# EAGLE design pcb_univ_3-1-0-x-rev2 (EAGLE 7.3.0)
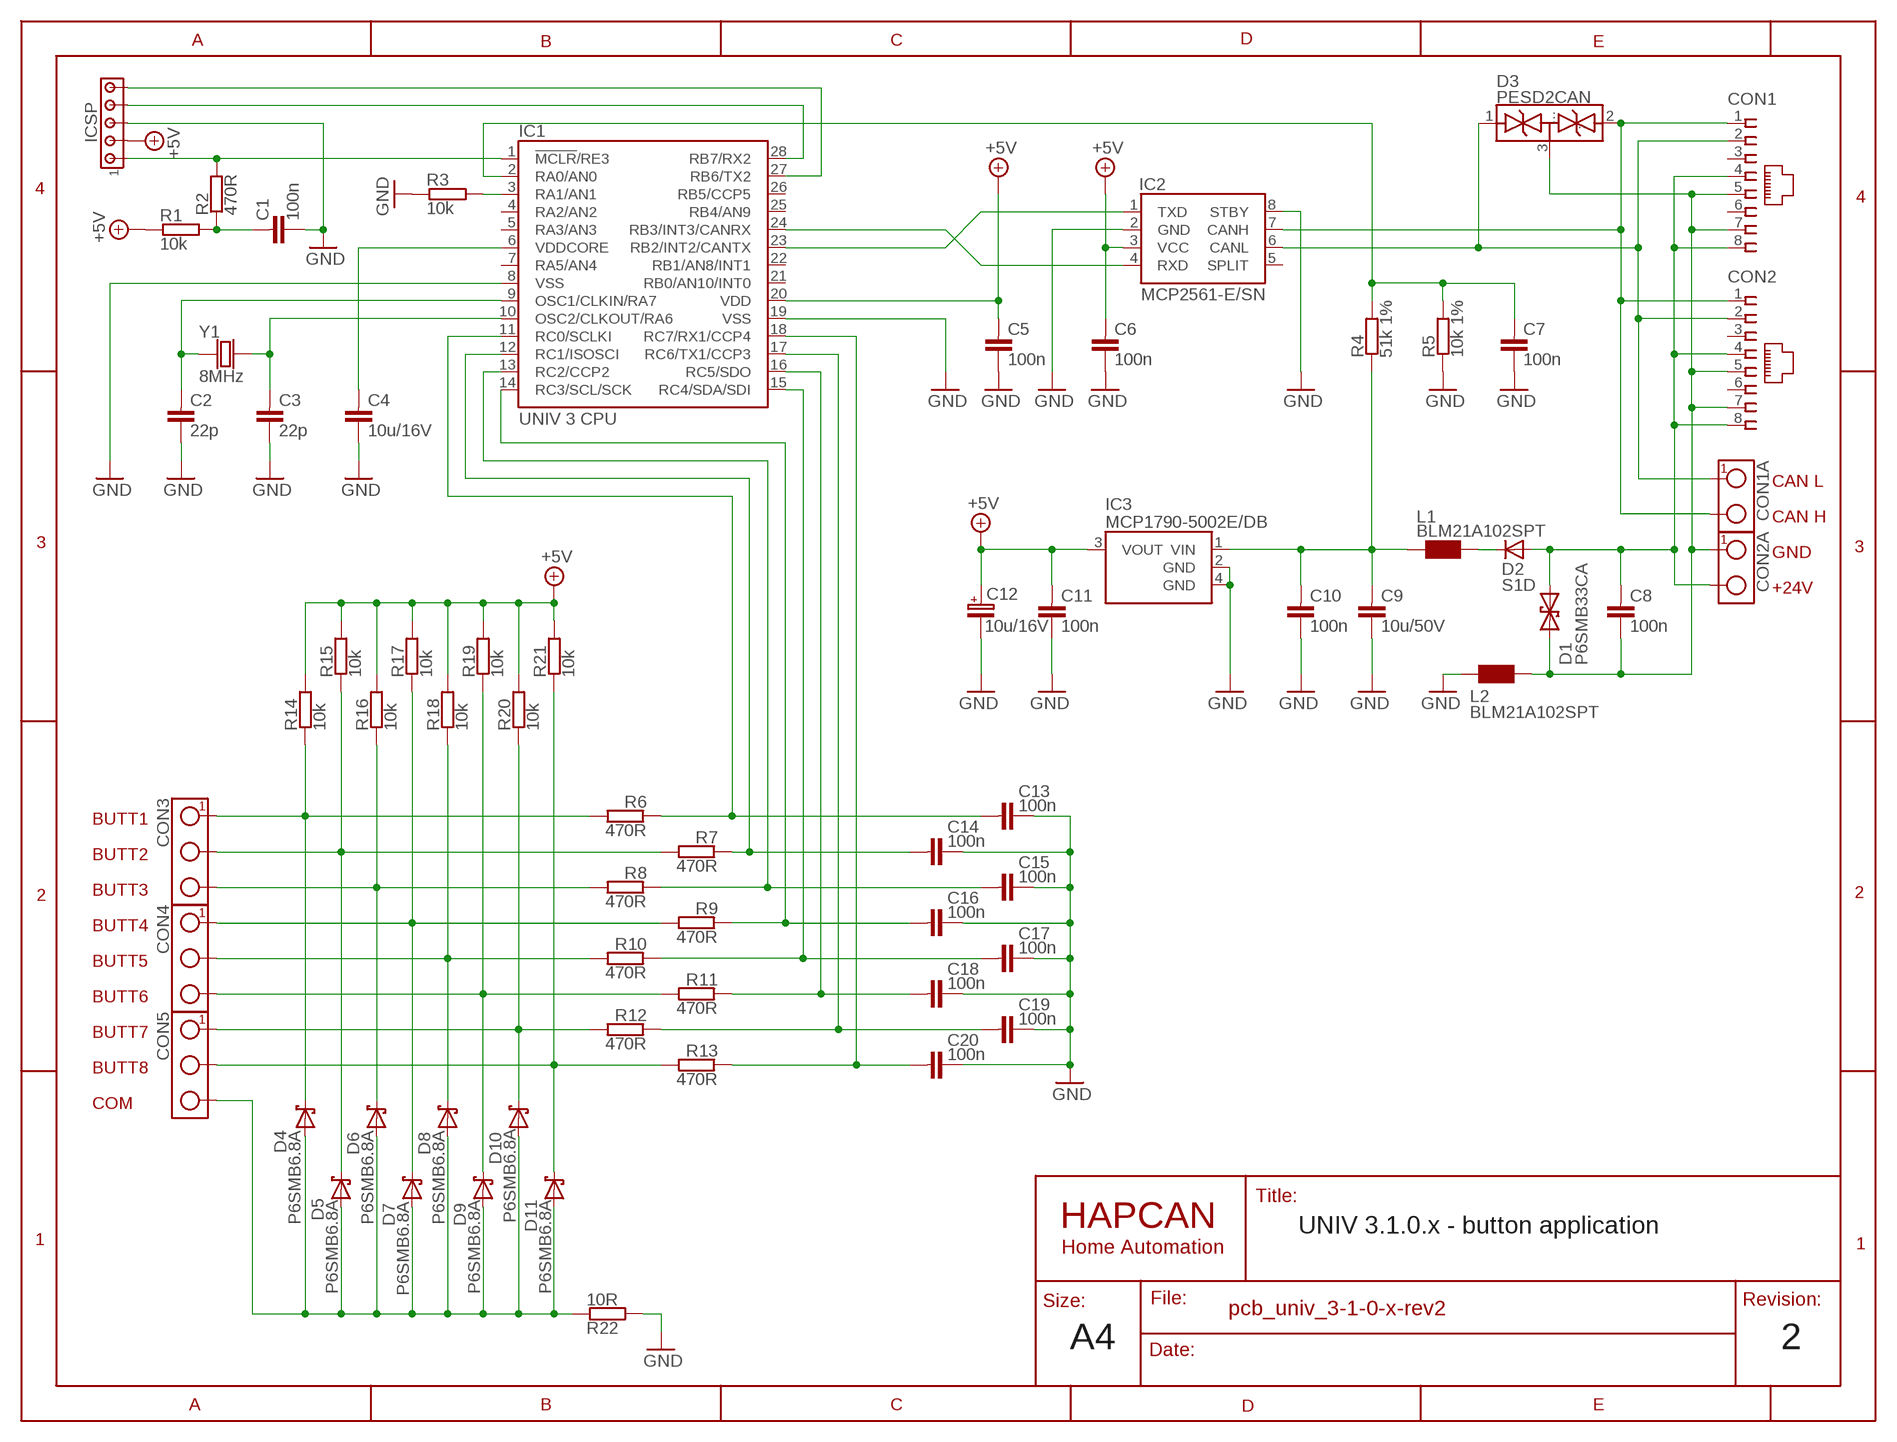
[diagram p0: schematic, sheet 1]

## Parts
C1  100n  CAPACITOR0805  [0805]
C2  22p  CAPACITOR0805  [0805]
C3  22p  CAPACITOR0805  [0805]
C4  10u/16V  CAPACITOR0805  [0805]
C5  100n  CAPACITOR0805  [0805]
C6  100n  CAPACITOR0805  [0805]
C7  100n  CAPACITOR0805  [0805]
C8  100n  CAPACITOR0805  [0805]
C9  10u/50V  CAPACITOR1210  [1210]
C10  100n  CAPACITOR0805  [0805]
C11  100n  CAPACITOR0805  [0805]
C12  10u/16V  CAPACITOR-POLARIZED-SMC_B  [SMC_B]
C13  100n  CAPACITOR0805  [0805]
C14  100n  CAPACITOR0805  [0805]
C15  100n  CAPACITOR0805  [0805]
C16  100n  CAPACITOR0805  [0805]
C17  100n  CAPACITOR0805  [0805]
C18  100n  CAPACITOR0805  [0805]
C19  100n  CAPACITOR0805  [0805]
C20  100n  CAPACITOR0805  [0805]
CON1  RJ45-SOCKET  [RJ45-PCB-SOCKET]
CON1A  TERMINAL-2  TERMINAL-2-5X10,5MM  [ARK2-5X10,5MM]
CON2  RJ45-SOCKET  [RJ45-PCB-SOCKET]
CON2A  TERMINAL-2  TERMINAL-2-5X10,5MM  [ARK2-5X10,5MM]
CON3  TERMINAL-3  TERMINAL-3-5X10.5MM  [ARK3-5X10.5MM]
CON4  TERMINAL-3  TERMINAL-3-5X10.5MM  [ARK3-5X10.5MM]
CON5  TERMINAL-3  TERMINAL-3-5X10.5MM  [ARK3-5X10.5MM]
D1  P6SMB33CA  DIODE_TRANSIL2  [DO-214_TRANSIL2]
D2  S1D  DIODE_DO-214  [DO-214]
D3  PESD2CAN  PESD2CANSOT-23  [SOT-23]
D4  P6SMB6.8A  DIODE_TRANSIL1_DO214  [DO-214]
D5  P6SMB6.8A  DIODE_TRANSIL1_DO214  [DO-214]
D6  P6SMB6.8A  DIODE_TRANSIL1_DO214  [DO-214]
D7  P6SMB6.8A  DIODE_TRANSIL1_DO214  [DO-214]
D8  P6SMB6.8A  DIODE_TRANSIL1_DO214  [DO-214]
D9  P6SMB6.8A  DIODE_TRANSIL1_DO214  [DO-214]
D10  P6SMB6.8A  DIODE_TRANSIL1_DO214  [DO-214]
D11  P6SMB6.8A  DIODE_TRANSIL1_DO214  [DO-214]
IC1  UNIV 3 CPU  UNIV3CPU-I/SO  [UNIV3CPU]
IC2  MCP2561-E/SN  [SO-08]
IC3  MCP1790-5002E/DB  MCP1790  [SOT-223]
ICSP  HEADER5  [SIP-5]
L1  BLM21A102SPT  CHOKE0805  [0805]
L2  BLM21A102SPT  CHOKE0805  [0805]
R1  10k  RESISTOR0805  [0805]
R2  470R  RESISTOR0805  [0805]
R3  10k  RESISTOR0805  [0805]
R4  51k 1%  RESISTOR0805  [0805]
R5  10k 1%  RESISTOR0805  [0805]
R6  470R  RESISTOR0805  [0805]
R7  470R  RESISTOR0805  [0805]
R8  470R  RESISTOR0805  [0805]
R9  470R  RESISTOR0805  [0805]
R10  470R  RESISTOR0805  [0805]
R11  470R  RESISTOR0805  [0805]
R12  470R  RESISTOR0805  [0805]
R13  470R  RESISTOR0805  [0805]
R14  10k  RESISTOR0805  [0805]
R15  10k  RESISTOR0805  [0805]
R16  10k  RESISTOR0805  [0805]
R17  10k  RESISTOR0805  [0805]
R18  10k  RESISTOR0805  [0805]
R19  10k  RESISTOR0805  [0805]
R20  10k  RESISTOR0805  [0805]
R21  10k  RESISTOR0805  [0805]
R22  10R  RESISTOR0805  [0805]
Y1  8MHz  CRYSTAL-HC49V  [CRYSTAL-HC49V]

## Nets
+5V: C5.1 C6.1 C11.1 C12.+ IC1.20(VDD) IC2.3(VCC) IC3.3(VOUT) ICSP.2 R1.1 R14.2 R15.2 R16.2 R17.2 R18.2 R19.2 R20.2 R21.2
GND: C1.2 C2.2 C3.2 C4.2 C5.2 C6.2 C7.2 C9.2 C10.2 C11.2 C12.- C13.2 C14.2 C15.2 C16.2 C17.2 C18.2 C19.2 C20.2 IC1.8(VSS) IC1.19(VSS) IC2.2(GND) IC2.8(STBY) IC3.2(GND) IC3.4(GND) ICSP.3 L2.1 R3.1 R5.1 R22.2
N$1: CON5.3 D4.A D5.A D6.A D7.A D8.A D9.A D10.A D11.A R22.1
N$2: IC1.24(RB3/INT3/CANRX) IC2.4(RXD)
N$3: IC1.23(RB2/INT2/CANTX) IC2.1(TXD)
N$4: CON1.1 CON1A.2 CON2.1 D3.2(..) IC2.7(CANH)
N$5: CON3.1 D4.C R6.2 R14.1
N$6: CON3.3 D6.C R8.2 R16.1
N$7: C1.1 R1.2 R2.1
N$8: IC1.1(!MCLR!/RE3) ICSP.1 R2.2
N$9: C8.1 CON1.4 CON1.8 CON2.4 CON2.8 CON2A.2 D1.A D2.A
N$10: IC1.28(RB7/RX2) ICSP.4
N$11: C14.1 IC1.12(RC1/ISOSCI) R7.1
N$12: IC1.3(RA1/AN1) R3.2
N$13: CON3.2 D5.C R7.2 R15.1
N$14: IC1.27(RB6/TX2) ICSP.5
N$15: C3.1 IC1.10(OSC2/CLKOUT/RA6) Y1.2
N$16: C7.1 IC1.2(RA0/AN0) R4.2 R5.2
N$17: C9.1 C10.1 IC3.1(VIN) L1.1 R4.1
N$18: C8.2 CON1.5 CON1.7 CON2.5 CON2.7 CON2A.1 D1.C D3.3(...) L2.2
N$19: C15.1 IC1.13(RC2/CCP2) R8.1
N$21: CON4.1 D7.C R9.2 R17.1
N$22: C16.1 IC1.14(RC3/SCL/SCK) R9.1
N$23: CON4.3 D9.C R11.2 R19.1
N$24: CON5.1 D10.C R12.2 R20.1
N$25: C13.1 IC1.11(RC0/SCLKI) R6.1
N$27: CON1.2 CON1A.1 CON2.2 D3.1(.) IC2.6(CANL)
N$29: C17.1 IC1.15(RC4/SDA/SDI) R10.1
N$30: CON4.2 D8.C R10.2 R18.1
N$32: CON5.2 D11.C R13.2 R21.1
N$40: C2.1 IC1.9(OSC1/CLKIN/RA7) Y1.1
N$45: C18.1 IC1.16(RC5/SDO) R11.1
N$46: C19.1 IC1.17(RC6/TX1/CCP3) R12.1
N$47: C20.1 IC1.18(RC7/RX1/CCP4) R13.1
N$56: C4.1 IC1.6(VDDCORE)
N$67: D2.C L1.2
Unconnected: CON1.3 CON1.6 CON2.3 CON2.6 IC1.4(RA2/AN2) IC1.5(RA3/AN3) IC1.7(RA5/AN4) IC1.21(RB0/AN10/INT0) IC1.22(RB1/AN8/INT1) IC1.25(RB4/AN9) IC1.26(RB5/CCP5) IC2.5(SPLIT)

## Notes on the sheet
- CAN L
- CAN H
- GND
- +24V
- BUTT1
- BUTT2
- BUTT3
- BUTT4
- BUTT5
- BUTT6
- BUTT7
- BUTT8
- COM
- UNIV 3.1.0.x - button application
- A4 | 2

## Library data of the parts
C1-C11 C13-C20 = HAPCAN_devices - UNIV3:CAPACITOR: HAPCAN Capacitor
C12 = HAPCAN_devices - UNIV3:CAPACITOR-POLARIZED: HAPCAN Polarazied Capacitor
CON1 CON2 = HAPCAN_devices - UNIV3:RJ45-SOCKET: HAPCAN RJ45 socket
CON1A CON2A = HAPCAN_devices - UNIV3:TERMINAL-2: HAPCAN Terminal Block - 2 way
CON3-CON5 = HAPCAN_devices - UNIV3:TERMINAL-3: HAPCAN Terminal Block - 3 way
D1 = HAPCAN_devices - UNIV3-eagle5:DIODE_TRANSIL2: HAPCAN Bidirectional transil diode
D2 = HAPCAN_devices - UNIV3:DIODE: HAPCAN Rectifier Diode
D3 = HAPCAN_devices - UNIV3:PESD2CAN: CAN bus ESD protection diode
D4-D11 = HAPCAN_devices - UNIV3:DIODE_TRANSIL1: HAPCAN Unidirectional transil diode
IC1 = HAPCAN_devices - UNIV3:UNIV3CPU: HAPCAN Microcontroller UNIV 3 CPU
IC2 = HAPCAN_devices - UNIV3:MCP2561: HAPCAN CAN Tranceiver
IC3 = HAPCAN_devices - UNIV3:MCP1790: 70 mA, High Voltage Regulator
ICSP = HAPCAN_devices - UNIV3:HEADER5: HAPCAN Header 5
L1 L2 = HAPCAN_devices - UNIV3:CHOKE: Choke
R1-R22 = HAPCAN_devices - UNIV3:RESISTOR: HAPCAN Resistor
Y1 = HAPCAN_devices - UNIV3:CRYSTAL: HAPCAN Crystal

## Board
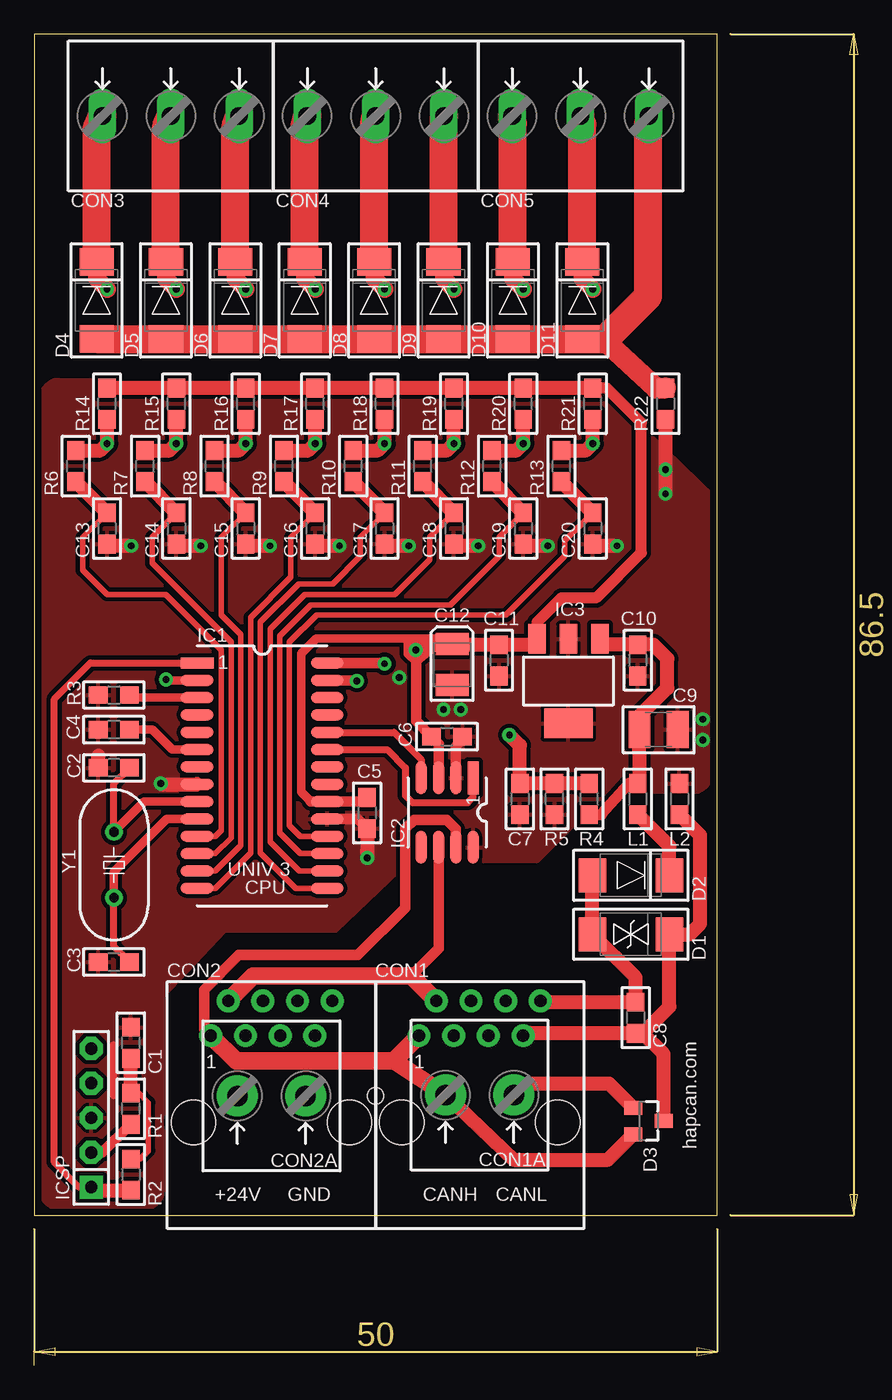
[diagram p1: board, top side]
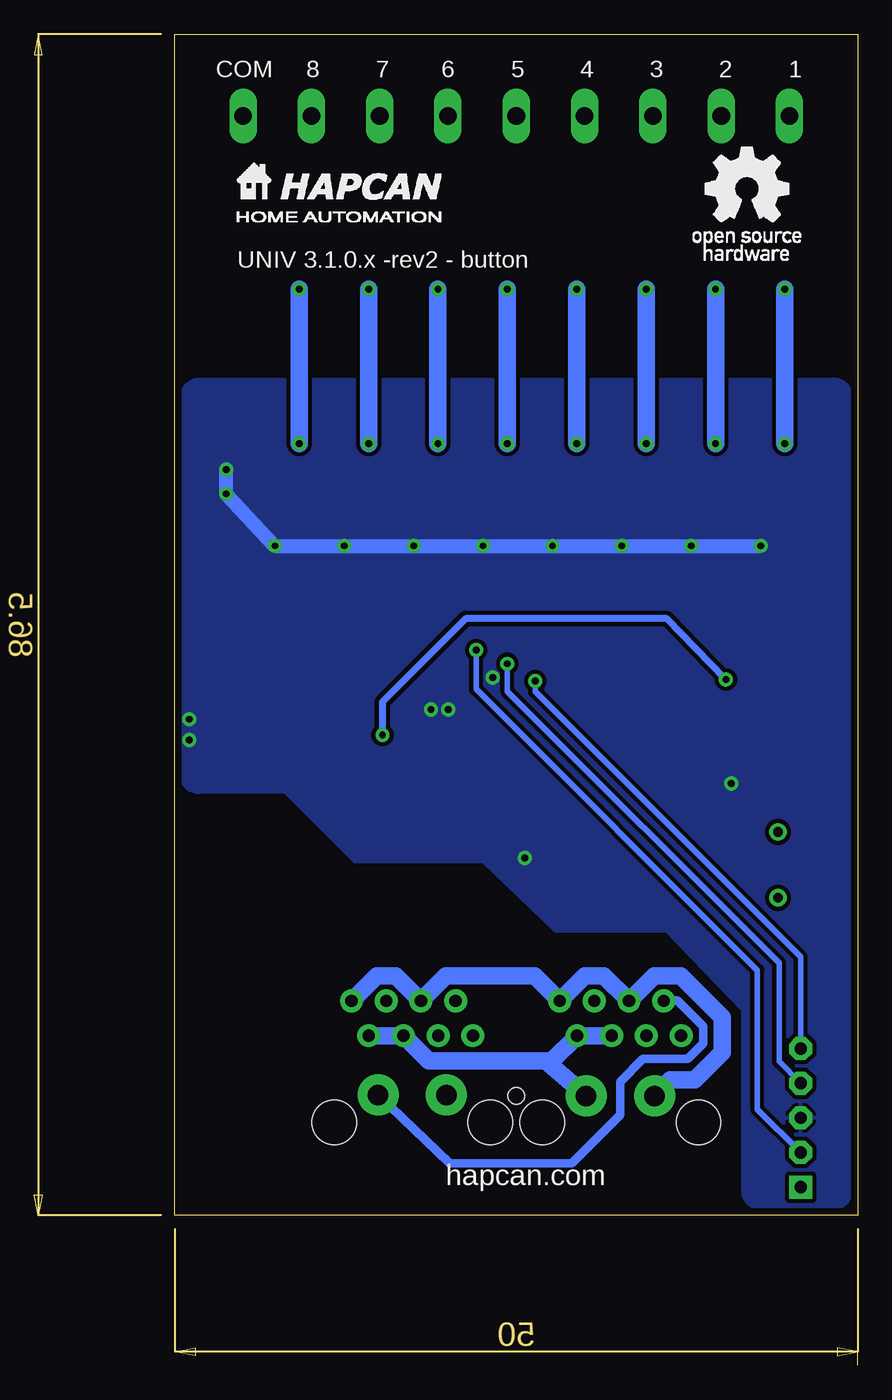
[diagram p2: board, bottom side, seen from below]

Size 50 x 97.5 mm. Coordinates in mm from the lower left corner, seen from the top.
Outline: 0,0.01 0,0 0,1
Outline: 0,11 50,11 50,97.5 0,97.5 0,11
Copper layers (1*16): Top 0.035mm / dielectric 1.5mm / Bottom 0.035mm
Design rules "HAPCAN-Drc *": minimum track width 12mil, minimum drill 0.5mm, track to track 12mil, track to pad 12mil, pad to pad 12mil, via to via 12mil, smd to smd 10mil, copper to edge 20mil, drill to drill 8mil, minimum pad ring 10mil, minimum via ring 10mil, stop-mask expansion 4mil, vias tented up to drill 0mil, thermal gap 10mil
Holes 1.2 mm at 25,19.74
tKeepout: 4 lines

### Footprints (pad centres in the part's own frame; a part is rotated, then mirrored left to right if it is on the bottom)
0805 = smd 1.372 x 1.27: 1 -1.143,0; 2 1.143,0
1210 = smd 1.6 x 2.7: 1 -1.4,0; 2 1.4,0
SMC_B = smd 1.6 x 2.4: + -1.5,0; - 1.5,0
RJ45-PCB-SOCKET = drill 0.9 pad 1.676: 1 -4.445,6.35; 2 -3.175,8.89; 3 -1.905,6.35; 4 -0.635,8.89; 5 0.635,6.35; 6 1.905,8.89; 7 3.175,6.35; 8 4.445,8.89 | hole 3.251: -5.715,0; 5.715,0
ARK2-5X10,5MM = drill 1.5 pad 3: 1 -2.5,0; 2 2.5,0
ARK3-5X10.5MM = drill 1.3 pad 2 long: 1 -5,0; 2 0,0; 3 5,0
DO-214_TRANSIL2 = smd 2 x 2.5: A 2.82,0; C -2.82,0
DO-214 = smd 2 x 2.5: A 2.82,0; C -2.82,0
SOT-23 = smd 1.016 x 1.321: 1 -0.965,-1.118; 2 0.965,-1.118; 3 0,1.118
UNIV3CPU = smd 2.4 x 0.8: 1 -4.763,8.255; 2 -4.763,6.985; 3 -4.763,5.715; 4 -4.763,4.445; 5 -4.763,3.175; 6 -4.763,1.905; 7 -4.763,0.635; 8 -4.763,-0.635; 9 -4.763,-1.905; 10 -4.763,-3.175; 11 -4.763,-4.445; 12 -4.763,-5.715; 13 -4.763,-6.985; 14 -4.763,-8.255; 15 4.763,-8.255; 16 4.763,-6.985; 17 4.763,-5.715; 18 4.763,-4.445; 19 4.763,-3.175; 20 4.763,-1.905; 21 4.763,-0.635; 22 4.763,0.635; 23 4.763,1.905; 24 4.763,3.175; 25 4.763,4.445; 26 4.763,5.715; 27 4.763,6.985; 28 4.763,8.255
SO-08 = smd 2.4 x 0.8: 1 -2.54,1.905; 2 -2.54,0.635; 3 -2.54,-0.635; 4 -2.54,-1.905; 5 2.54,-1.905; 6 2.54,-0.635; 7 2.54,0.635; 8 2.54,1.905
SOT-223 = smd 1.27 x 2.159: 1 -2.311,-3.099; 2 0,-3.099; 3 2.311,-3.099 | smd 3.556 x 2.159: 4 0,3.099
SIP-5 = drill 0.9 pad 1.676 square: 1 -5.08,0 | drill 0.9 pad 1.676 octagon: 2 -2.54,0; 3 0,0; 4 2.54,0; 5 5.08,0
CRYSTAL-HC49V = drill 0.7 pad 1.27: 1 -2.413,0; 2 2.413,0

### Placement (x,y rotation side)
C1  7.08,23.63 90 top
C2  5.84,43.77 180 top
C3  5.84,29.54 180 top
C4  5.84,46.56 180 top
C5  24.38,40.46 270 top
C6  30.23,46.05 0 top
C7  35.56,41.48 270 top
C8  44.04,25.47 270 top
C9  45.72,46.56 0 top
C10  44.2,51.64 270 top
C11  34.04,51.64 270 top
C12  30.61,51.32 270 top
C13  5.33,61.29 270 top
C14  10.41,61.29 270 top
C15  15.49,61.29 270 top
C16  20.57,61.29 270 top
C17  25.65,61.29 270 top
C18  30.73,61.29 270 top
C19  35.81,61.29 270 top
C20  40.89,61.29 270 top
CON1  32.62,17.8 0 top
CON1A  32.62,19.8 180 top
CON2  17.38,17.8 0 top
CON2A  17.38,19.74 180 top
CON3  10,91.5 0 top
CON4  25,91.5 0 top
CON5  40,91.5 0 top
D1  43.69,31.57 180 top
D2  43.69,35.89 180 top
D3  44.98,17.9 270 top
D4  4.57,78 270 top
D5  9.65,78 270 top
D6  14.73,78 270 top
D7  19.81,78 270 top
D8  24.89,78 270 top
D9  29.97,78 270 top
D10  35.05,78 270 top
D11  40.13,78 270 top
IC1  16.7,43.19 0 top
IC2  30.24,40.49 270 top
IC3  39.12,50.12 180 top
ICSP  4.18,18.13 90 top
L1  44.2,41.48 270 top
L2  47.24,41.48 270 top
R1  7.08,18.8 90 top
R2  7.08,13.97 270 top
R3  5.84,49.1 0 top
R4  40.64,41.48 90 top
R5  38.1,41.48 90 top
R6  3.05,65.86 90 top
R7  8.13,65.86 90 top
R8  13.21,65.86 90 top
R9  18.29,65.86 90 top
R10  23.37,65.86 90 top
R11  28.45,65.86 90 top
R12  33.53,65.86 90 top
R13  38.61,65.86 90 top
R14  5.33,70.44 90 top
R15  10.41,70.44 90 top
R16  15.49,70.44 90 top
R17  20.57,70.44 90 top
R18  25.65,70.44 90 top
R19  30.73,70.44 90 top
R20  35.81,70.44 90 top
R21  40.89,70.44 90 top
R22  46.23,70.44 270 top
Y1  5.84,36.65 270 top

### Tracks (layer width: path | path; a pad name or v marks a point on that pad's centre or on a via)
+5V  (via drill 0.5 pad 1.02)
  Top 0.61: 20.26,41.29 19.56,41.99 19.56,52.15 20.65,53.24 27.86,53.24 arc-90 27.94,53.16
  Top 0.762: 20.26,41.29 IC1.20 24.07,41.29 C5.1 | C12.+ 30.52,52.91 29.72,53.16 29.21,53.16 | 29.21,53.16 27.94,53.16 v27.94,52.4 | 27.99,51.64 27.99,47.2 C6.1 29.61,45.53 IC2.3 | 27.43,52.78 27.43,52.15 27.99,51.64 | 27.99,51.64 29.21,52.66 29.21,53.16 | 29.21,53.16 28.19,52.4 v27.94,52.4 | v27.94,52.4 27.69,52.4 | v27.94,52.4 28.19,52.66 27.69,52.66 v27.94,52.4 | v27.94,52.4 28.19,52.15 27.94,51.89 | 27.94,51.89 27.99,51.64 | v27.94,52.4 27.94,51.89 | R1.1 5,15.6 ICSP.2
  Top 0.813: IC3.3 36.8,54.41 38.61,56.21 41.15,56.21 44.45,59.51 44.45,69.04 41.91,71.58 R21.2 | C12.+ 30.65,52.78
  Top 1.016: R14.2 R15.2 R16.2 R17.2 R18.2 R19.2 R20.2 R21.2 | IC3.3 36.37,52.78 C11.1 30.65,52.78
  Bottom 0.406: v27.94,52.4 27.94,49.53 7.34,28.93 7.34,18.75 ICSP.2
GND  (via drill 0.5 pad 1.02)
  Top 0.508: 5.82,19.77 5.82,23.5
  Top 0.762: IC2.2 30.88,45.3 C6.2 | IC1.19 23.68,40.02 C5.2 | v9.27,42.62 9.34,42.69 9.34,42.56
  Top 1.016: v12.19,60.02 10.54,60.02 C14.2 | v7.11,60.02 5.46,60.02 C13.2 | v17.27,60.02 15.62,60.02 C15.2 | v22.35,60.02 20.7,60.02 C16.2 | v27.43,60.02 25.78,60.02 C17.2 | v32.51,60.02 30.86,60.02 C18.2 | v37.59,60.02 35.94,60.02 C19.2 | v42.67,60.02 41.02,60.02 C20.2 | v46.23,63.83 R22.2 | C2.2 4.7,44.66 | 9.34,42.56 IC1.8 | C5.2 24.38,37.67 v24.38,37.16
  Bottom 1.016: v7.11,60.02 v12.19,60.02 v17.27,60.02 v22.35,60.02 v27.43,60.02 v32.51,60.02 v37.59,60.02 v42.67,60.02 v46.23,63.83 v46.23,65.61
  other vias: 31.24,48.03 29.97,48.03 48.95,47.32 48.95,45.8 26.72,50.37
  pour Bottom (isolate 0.305, rank 6): 1.78,11.51 7.11,11.51 arc90 8.38,12.78 8.38,25.99 13.97,31.83 22.1,31.83 27.43,36.91 36.83,36.91 41.91,41.99 48.26,41.99 arc90 49.53,43.26 49.53,70.69 arc90 48.26,72.21 1.78,72.21 arc90 0.51,70.94 0.51,12.78 arc90
  pour Top (isolate 0.305): 0.51,70.69 arc-90 1.78,72.21 41.4,71.71 49.78,63.58 49.53,43.77 arc-90 48.51,41.99 41.91,41.99 36.83,36.91 27.43,36.91 22.1,31.83 13.97,31.83 9.4,27 9.4,12.78 arc-90 8.13,11.51 1.78,11.51 arc-90 0.51,12.78
N$1
  Top 1.524: R22.1 45.53,71.56 41.66,75.18
  Top 1.93: 44.96,90.96 CON5.3
  Top 2.032: 44.96,90.96 44.96,78.31 41.83,75.18 41.66,75.18 D11.A D10.A D9.A D8.A D7.A D6.A D4.A D5.A
N$2
  Top 0.508: IC2.4 28.34,44.38 26.36,46.37 IC1.24
N$3
  Top 0.508: IC2.1 32.15,41.62 31.75,41.23 27.69,41.23 27.18,41.73 27.18,43.77 25.85,45.1 IC1.23
N$4
  Top 0.762: IC2.7 30.88,39.3 30.23,39.96 27.81,39.96 27.18,39.32 27.18,33.52 23.71,30.05 14.99,30.05 12.45,27.51 12.45,24.64 CON2.1
  Top 1.016: D3.2 42,15.06 35.11,15.06 CON1A.2
  Top 1.27: CON2.1 14.78,22.3 26.33,22.3 | 26.33,22.3 CON1.1 | CON1A.2 26.33,22.3
N$5  (via drill 0.5 pad 1.02)
  Top 1.016: R6.2 4.83,67.01 v5.33,67.52 R14.1
  Top 1.27: D4.C 4.57,79.58 v5.33,78.82
  Top 2.032: D4.C 4.57,90.57 CON3.1
  Bottom 1.27: v5.33,67.52 v5.33,78.82
N$6  (via drill 0.5 pad 1.02)
  Top 1.016: R8.2 14.99,67.01 v15.49,67.52 R16.1
  Top 1.27: D6.C 14.73,79.58 v15.49,78.82
  Top 2.032: D6.C 14.73,90.73 CON3.3
  Bottom 1.27: v15.49,67.52 v15.49,78.82
N$7
  Top 0.406: R1.2 7.66,19.94 8.36,19.24 8.36,15.72 7.76,15.12 R2.1
  Top 1.016: R1.2 C1.1
N$8
  Top 0.508: IC1.1 4.12,51.45 1.47,48.8 1.47,14.86 3.28,13.06 ICSP.1
  Top 1.016: R2.2 4.12,12.83 ICSP.1
N$9
  Top 1.016: D2.A D1.A 44.04,28.4 C8.1 37.15,26.61 CON1.8
  Bottom 1.27: CON1.8 35.23,28.53 33.82,28.53 CON1.4 30.15,28.53 23.66,28.53 CON2.8 19.99,28.53 18.58,28.53 CON2.4 14.91,28.53 12.95,28.53 9.91,25.48 9.91,22.94 11.94,20.91 13.71,20.91 CON2A.2
N$10  (via drill 0.5 pad 1.02)
  Top 0.762: IC1.28 25.59,51.45 v25.65,51.39
  Bottom 0.406: v25.65,51.39 25.65,49.35 5.77,29.47 5.77,22.25 ICSP.4
N$11
  Top 0.406: IC1.12 13.27,37.48 14.43,38.64 14.43,52.96 8.64,58.75 8.64,60.66 C14.1
  Top 1.016: C14.1 R7.1
N$12
  Top 0.61: IC1.3 7.18,48.91 R3.2
N$13  (via drill 0.5 pad 1.02)
  Top 1.016: R7.2 9.91,67.01 v10.41,67.52 R15.1
  Top 1.27: D5.C 9.65,79.58 v10.41,78.82
  Top 2.032: D5.C 9.65,90.65 CON3.2
  Bottom 1.27: v10.41,67.52 v10.41,78.82
N$14  (via drill 0.5 pad 1.02)
  Top 0.762: IC1.27 23.31,50.18 v23.62,50.12
  Bottom 0.406: ICSP.5 4.18,29.91 23.62,49.35 v23.62,50.12
N$15
  Top 0.508: Y1.2 5.84,30.68 C3.1
  Top 0.61: IC1.10 9.71,40.02 5.84,36.15 Y1.2
N$16  (via drill 0.5 pad 1.02)
  Top 0.61: IC1.2 9.72,50.18 v9.65,50.24
  Top 1.016: R4.2 R5.2 C7.1 35.56,45.42 v34.8,46.18
  Bottom 0.508: v9.65,50.24 13.97,54.69 28.7,54.69 34.8,48.59 v34.8,46.18
N$17
  Top 0.813: R4.1 41.53,40.34 43.56,42.62 L1.1
  Top 1.016: L1.1 44.32,43 C9.1 44.32,47.57 46.35,49.61 46.35,51.77 45.34,52.78 C10.1 41.86,52.78 IC3.1
N$18
  Top 1.016: L2.2 48.77,38.81 48.77,32.34 48.01,31.57 D1.C 46.51,26.27 44.56,24.32 | D3.3 46.08,22.8 44.56,24.32 | 44.56,24.32 C8.2 35.97,24.32 CON1.7
  Bottom 1.27: CON2.5 CON2.7 22.4,22.3 22.86,22.3 | 22.86,22.3 31.41,22.3 CON1.5 CON1.7 | CON2A.1 22.86,22.3
N$19
  Top 0.406: IC1.13 13.27,36.21 15.14,38.08 15.14,53.52 13.72,54.94 13.72,60.66 C15.1
  Top 1.016: C15.1 R8.1
N$21  (via drill 0.5 pad 1.02)
  Top 1.016: R9.2 20.07,67.01 v20.57,67.52 R17.1
  Top 1.27: D7.C 19.81,79.58 v20.57,78.82
  Top 2.032: D7.C 19.81,90.81 CON4.1
  Bottom 1.27: v20.57,67.52 v20.57,78.82
N$22
  Top 0.406: IC1.14 13.27,34.94 15.85,37.52 15.85,54.79 18.8,57.74 18.8,60.66 C16.1
  Top 1.016: C16.1 R9.1
N$23  (via drill 0.5 pad 1.02)
  Top 1.016: R11.2 30.23,67.01 v30.73,67.52 R19.1
  Top 1.27: D9.C 29.97,79.58 v30.73,78.82
  Top 2.032: D9.C 29.97,90.97 CON4.3
  Bottom 1.27: v30.73,67.52 v30.73,78.82
N$24  (via drill 0.5 pad 1.02)
  Top 1.016: R12.2 35.31,67.01 v35.81,67.52 R20.1
  Top 1.27: D10.C 35.05,79.58 v35.81,78.82
  Top 2.032: D10.C 35.05,90.95 CON5.1
  Bottom 1.27: v35.81,67.52 v35.81,78.82
N$25
  Top 0.406: IC1.11 13.27,38.75 13.72,39.19 13.72,52.4 9.65,56.47 5.33,56.47 3.56,58.24 3.56,60.66 C13.1
  Top 1.016: C13.1 R6.1
N$27
  Top 0.406: CON1.2 30.03,26.69
  Top 0.762: IC2.6 29.61,30.52 27.61,28.53
  Top 1.016: D3.1 42.08,20.65 36.22,20.65 CON1A.1
  Top 1.27: CON2.2 16.04,28.53 27.61,28.53 CON1.2
  Bottom 0.61: CON1A.1 29.87,14.81 20.95,14.81 17.4,18.37 17.4,20.78 15.75,22.43 12.45,22.43 11.3,23.57 11.3,24.84 13.21,26.75 14.15,26.75 CON2.2
N$29
  Top 0.406: IC1.15 19.14,34.94 16.56,37.52 16.56,54.43 19.36,57.23 21.84,57.23 23.88,59.26 23.88,60.66 C17.1
  Top 1.016: C17.1 R10.1
N$30  (via drill 0.5 pad 1.02)
  Top 1.016: R10.2 25.15,67.01 v25.65,67.52 R18.1
  Top 1.27: D8.C 24.89,79.58 v25.65,78.82
  Top 2.032: D8.C 24.89,90.89 CON4.2
  Bottom 1.27: v25.65,67.52 v25.65,78.82
N$32  (via drill 0.5 pad 1.02)
  Top 1.016: R13.2 40.39,67.01 v40.89,67.52 R21.1
  Top 1.27: D11.C 40.13,79.58 v40.89,78.82
  Top 2.032: D11.C 40.13,90.87 CON5.2
  Bottom 1.27: v40.89,67.52 v40.89,78.82
N$40
  Top 0.508: Y1.1 5.84,42.62 C2.1
  Top 0.61: IC1.9 8.06,41.29 Y1.1
N$45
  Top 0.406: IC1.16 19.39,36.21 17.27,38.33 17.27,53.93 19.81,56.47 26.42,56.47 28.96,59.01 28.96,60.66 C18.1
  Top 1.016: C18.1 R11.1
N$46
  Top 0.406: IC1.17 19.5,37.48 17.98,38.99 17.98,53.42 20.27,55.7 30.48,55.7 34.04,59.26 34.04,60.66 C19.1
  Top 1.016: C19.1 R12.1
N$47
  Top 0.406: IC1.18 19.5,38.75 18.69,39.55 18.69,52.96 20.68,54.94 34.54,54.94 38.86,59.26 38.86,60.4 C20.1
  Top 1.016: C20.1 R13.1
N$56
  Top 0.61: C4.1 8.64,46.56 10.1,45.1 IC1.6
N$67
  Top 1.016: D2.C 46.51,38.02 L1.2

### Text on the board
tPlace: hapcan.com | +24V | GND | CANH | CANL
bPlace: 1 | 2 | 3 | 4 | 5 | 6 | 7 | 8 | COM | UNIV 3.1.0.x -rev2 - button | hapcan.com